# EAGLE schematic WS2812_Beschaltung (EAGLE 7.7.0)
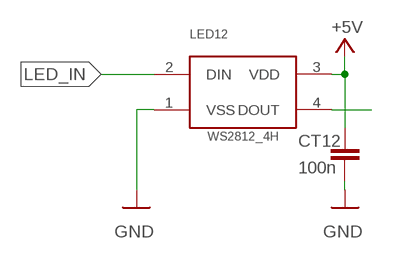
[diagram p0: schematic, sheet 1]

## Parts
CT12  100n  C-EUC0805  [C0805]
LED12  WS2812_4H  [WS2812_4]

## Nets
+5V: CT12.1 LED12.3(VDD)
GND: CT12.2 LED12.1(VSS)
LED_IN: LED12.2(DIN)
N$12: LED12.4(DOUT)

## Library data of the parts
CT12 = rcl:C-EU: CAPACITOR, European symbol
LED12 = sp2:WS2812_4